# Altium schematic sheet ECG_MCU_Core.SchDoc
size A; SheetNumber: 5; SheetTotal: 5
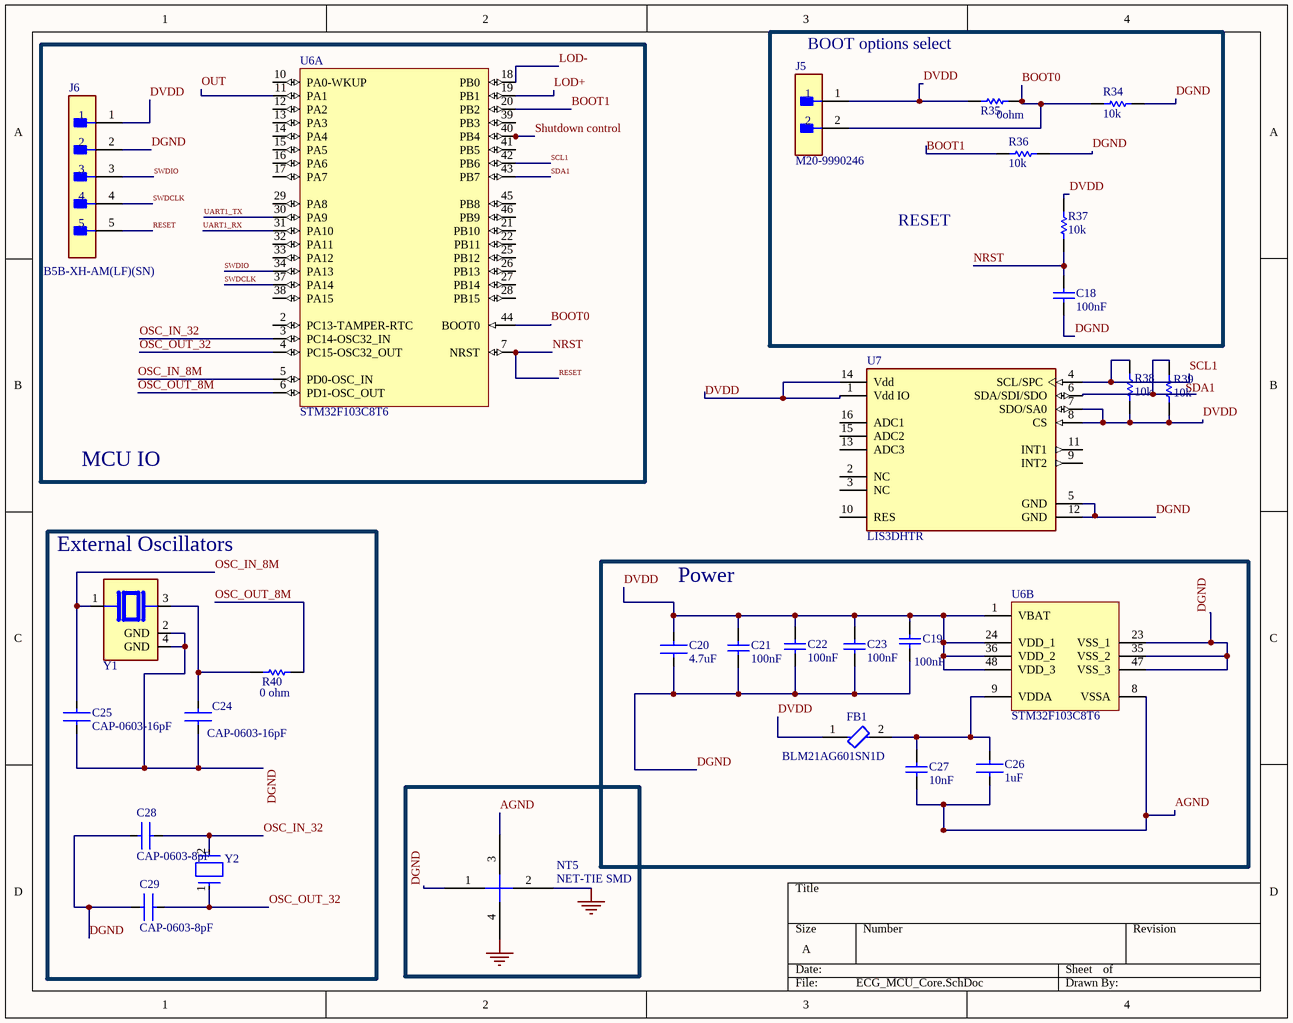
[diagram p0: ECG_MCU_Core.SchDoc]

## Parts
C18  100nF  [CAP-0603-IPC_B]
C19  100nF  [CAP-0603-IPC_B]
C20  4.7uF  [CAP-0805-IPC_B]
C21  100nF  [CAP-0603-IPC_B]
C22  100nF  [CAP-0603-IPC_B]
C23  100nF  [CAP-0603-IPC_B]
C24  CAP-0603-16pF  [FP-GCM188-0_1-IPC_A_murata]
C25  CAP-0603-16pF  [FP-GCM188-0_1-IPC_A_murata]
C26  1uF  [CAP-0805-IPC_B]
C27  10nF  [CAP-0603-IPC_B]
C28  CAP-0603-8pF  [FP-GCM188-0_1-IPC_A_murata]
C29  CAP-0603-8pF  [FP-GCM188-0_1-IPC_A_murata]
FB1  BLM21AG601SN1D  [Ferrite bead]
J5  M20-9990246  [FP-M20-9990246-MFG]
J6  B5B-XH-AM(LF)(SN)  [FP-B5B-XH-AM_LF_SN-MFG]
NT5  NET-TIE SMD  [NET TIE SMD]
R34  10k  [RES-0603-IPC_B]
R35  0ohm  [RES-0603-IPC_B]
R36  10k  [RES-0603-IPC_B]
R37  10k  [RES-0603-IPC_B]
R38  10k  [RES-0603-IPC_B]
R39  10k  [RES-0603-IPC_B]
R40  0 ohm  [RES-0603-IPC_B]
U6  STM32F103C8T6  [STM-LQFP48_M]  (parts A,B of 2)
U7  LIS3DHTR  [FP-LGA-16-7983231-MFG]
Y1  ABM8AIG-8.000MHZ-1Z-T_1  [XTAL_ABM8AIG-8.000MHZ-1Z-T]  (value not drawn)
Y2  ABS07-32.768KHZ-6-T  [FP-ABS07-MFG]  (value not drawn)

## Blocks framed on the sheet
MCU IO: J6 U6
External Oscillators: C24 C25 C28 C29 R40 Y1 Y2
Power: C19-C23 C26 C27 FB1 U6

## Nets
GND: NT5.2
AGND: C26.1 C27.1 NT5.3 U6.8(VSSA)
BOOT0: J5.2 R34.1 R35.2 U6.44(BOOT0)
BOOT1: R36.1 U6.20(PB2)
DGND: C18.1 C19.1 C20.2 C21.1 C22.1 C23.1 C24.1 C25.1 C28.2 C29.1 J6.2 NT5.1 R34.2 R36.2 U6.23(VSS_1) U6.35(VSS_2) U6.47(VSS_3) U7.5(GND) U7.12(GND) Y1.2(GND) Y1.4(GND)
DVDD: C19.2 C20.1 C21.2 C22.2 C23.2 FB1.1 J5.1 J6.1 R35.1 R37.2 R38.1 R39.1 U6.1(VBAT) U6.24(VDD_1) U6.36(VDD_2) U6.48(VDD_3) U7.1(Vdd_IO) U7.7(SDO/SA0) U7.8(CS) U7.14(Vdd)
LOD+: U6.19(PB1)
LOD-: U6.18(PB0)
NRST: C18.2 J6.5 R37.1 U6.7(NRST)  [also labelled RESET]
OSC_IN_8M: C25.2 U6.5(PD0-OSC_IN) Y1.1
OSC_IN_32: C28.1 U6.3(PC14-OSC32_IN) Y2.2
OSC_OUT_8M: R40.2 U6.6(PD1-OSC_OUT)
OSC_OUT_32: C29.2 U6.4(PC15-OSC32_OUT) Y2.1
OUT: U6.11(PA1)
SCL1: R38.2 U6.42(PB6) U7.4(SCL/SPC)
SDA1: U6.43(PB7)
Shutdown control: U6.40(PB4)
SWDCLK: J6.4 U6.37(PA14)
SWDIO: J6.3 U6.34(PA13)
UART1_RX: U6.31(PA10)
UART1_TX: U6.30(PA9)
NetC24_2: C24.2 R40.1 Y1.3
NetC26_2: C26.2 C27.2 FB1.2 U6.9(VDDA)
NetR39_2: R39.2 U7.6(SDA/SDI/SDO)

Not connected (* = marked no-connect by the designer): NT5 4; U6 2(PC13-TAMPER-RTC) 10(PA0-WKUP) 12(PA2) 13(PA3) 14(PA4) 15(PA5) 16(PA6) 17(PA7) 21(PB10) 22(PB11) 25(PB12) 26(PB13) 27(PB14) 28(PB15) 29(PA8) 32(PA11) 33(PA12) 38(PA15) 39(PB3) 41(PB5) 45(PB8) 46(PB9); U7 2(NC) 3(NC) 9(INT2) 10(RES) 11(INT1) 13(ADC3) 15(ADC2) 16(ADC1)

## Notes on the sheet
- BOOT options select
- RESET
- Labels drawn without touching a wire or pin: GND, SDA1

## Library data of the parts
C18 = 1nF CAP-0603-IPC-B_1: Manufacturer: AVX Interconnect / Elco; Part Number: 0603ZC103MAT2A
C19 C21-C23 C27 = CAP-0603-IPC-B: Manufacturer: AVX Interconnect / Elco; Part Number: 0603ZC103MAT2A
C20 = 4.7uF CAP-0805-IPC-B_1
C24 C25 = CAP-0603_16V- 16pf_murata: Ceramic Capacitor for Automotive 16pF  ±5% 100VDC C0G 0603 Paper T/R; Voltage Rating: 100V; Min Operating Temperature: -55°C; Package Quantity: 4000; Case/Package: 0603; Height: 0.8mm; Tolerance: 5%; Depth: 0.8mm; Thickness: 0.035inch; Max Operating Temperature: 125°C; Ratings: AEC-Q200; Packaging: Tape and Reel; Termination: SMD/SMT; Mount: Surface Mount; Voltage Rating (DC): 100V; Case Code (Imperial): 0603; Length: 1.6mm; Capacitance: 16pF; Case Code (Metric): 1608; Dielectric: C0G; Radiation Hardening: No; Width: 0.031inch
C26 = 1uF CAP-0805-IPC-B_1
C28 C29 = CAP-0603_16V- 8pF_murata: Ceramic Capacitor for Automotive 16pF  ±5% 100VDC C0G 0603 Paper T/R; Voltage Rating: 100V; Min Operating Temperature: -55°C; Package Quantity: 4000; Case/Package: 0603; Height: 0.8mm; Tolerance: 5%; Depth: 0.8mm; Thickness: 0.035inch; Max Operating Temperature: 125°C; Ratings: AEC-Q200; Packaging: Tape and Reel; Termination: SMD/SMT; Mount: Surface Mount; Voltage Rating (DC): 100V; Case Code (Imperial): 0603; Length: 1.6mm; Capacitance: 16pF; Case Code (Metric): 1608; Dielectric: C0G; Radiation Hardening: No; Width: 0.031inch
FB1 = CMP-0686-00639-3 Ferrite bead: Chip Ferrite Bead, 0805, 600Ω @ 100MHz, 0.2Ω, 25%, 700mA; Material: Steel; DC Current: 200mA; Impedance: 600R; Current Rating: 600mA; Number of Circuits: 1; Shielding: Unshielded; DC Resistance (DCR): 210mR; Temperature Coefficient: 10ppm/°C; Conductor Material: Copper; Radiation Hardening: No; Test Frequency: 100MHz; Height: 0.85mm; Max Current Rating: 700mA; REACH SVHC: No SVHC; Case Code (Metric): 2012; Max DC Current: 200mA; Min Operating Temperature: -55°C; ESR (Equivalent Series Resistance): 600R; Case/Package: 0805; Tolerance: 25%; Number of Pins: 2; Depth: 1.25mm; Lead Free: Lead Free; Frequency: 100MHz; Length: 2mm; Package Quantity: 1; Max Operating Temperature: 125°C; Case Code (Imperial): 0805; Width: 1.25mm; Core Material: Ferrite; RoHS Compliant: Yes; Termination: SMD/SMT; Number of Lines: 1; Packaging: Tape and Reel
J5 = CMP-15831-000009-1: CONN HEADER VERT 2POS 2.54MM; Manufacturer: Harwin; Conn Gender: Male; Conn Orientation: Vertical; Number Of Contacts: 2; Current Rating: 3A; ComponentLink2URL: https://cdn.harwin.com/pdfs/M20-999.pdf; ComponentLink2Description: Datasheet; Package: M20-9990246; Temperature: -40°C to +105°C; Octopart: https://octopart.com/m20-9990246-harwin-2590635; Mouser Description: 2.54mm (0.1") Pitch SIL Vertical PC Tail Pin Header, 6.1mm mating pin height, tin, 2 contacts; Temperature Range High: +105°C; Device Class L1: Connectors; RoHS: TRUE; Automotive: No; Height: 8.99mm; Number Of Rows: 1; Contact Material: Tin,Nickel; Category: Conn; Pitch: 2.54mm; Lead Free: Yes; Digikey Description: CONN HEADER VERT 2POS 2.54MM; Manufacturer Part Number: M20-9990246; Temperature Range Low: -40°C; Device Class L3: unset; Device Class L2: Headers and Wire Housings
J6 = CMP-17439-000304-1: CONN HEADER VERT 5POS 2.5MM; Mated Stacking Heights: 9.8mm; Voltage Rating: 250V; Max Current Rating: 3A; Number of Positions: 5; Contact Resistance: 20mR; Depth: 5.75mm; Connector Type: Header; Color: Green; Insulation Material: Nylon; Contact Plating: Copper; Length: 14.9mm; Fastening Type: Detent; Contact Material: Brass; Number of Rows: 1; Contact Type: Male Pin; Housing Material: Polyamide; Housing Color: White; Lead Free: Lead Free; Max Voltage Rating (AC): 250V; Mount: Through Hole; Contact Shape: Square; Min Operating Temperature: -25°C; Packaging: Bulk; Orientation: Straight; Insulation Color: Natural; Series: XH; Flammability Rating: UL94 V-0; Contact Finish - Mating: TIN; Max Operating Temperature: 85°C; Termination: Solder; Pitch: 2.5mm
R34 R36-R39 = 10k RES-0603-IPC-B_1_1: Max Power Dissipation: 100mW; Temperature Coefficient: 50ppm/°C; Tolerance: 0.5%; Resistance: 4.7kR; Height: 0.022inch; Width: 0.032inch; RoHS Compliant: Yes; Features: Moisture Resistant; Packaging: Tape and Reel; Number of Terminations: 2; Max Operating Temperature: 155°C; Series: AT; Min Operating Temperature: -55°C; Resistor Type: Thin Film; Length: 0.063inch; Case/Package: 0603
R35 = 1k RES-0603-IPC-B_1: Max Power Dissipation: 100mW; Temperature Coefficient: 50ppm/°C; Tolerance: 0.5%; Resistance: 4.7kR; Height: 0.022inch; Width: 0.032inch; RoHS Compliant: Yes; Features: Moisture Resistant; Packaging: Tape and Reel; Number of Terminations: 2; Max Operating Temperature: 155°C; Series: AT; Min Operating Temperature: -55°C; Resistor Type: Thin Film; Length: 0.063inch; Case/Package: 0603
R40 = RES-0603-IPC-B: Max Power Dissipation: 100mW; Temperature Coefficient: 50ppm/°C; Tolerance: 0.5%; Resistance: 4.7kR; Height: 0.022inch; Width: 0.032inch; RoHS Compliant: Yes; Features: Moisture Resistant; Packaging: Tape and Reel; Number of Terminations: 2; Max Operating Temperature: 155°C; Series: AT; Min Operating Temperature: -55°C; Resistor Type: Thin Film; Length: 0.063inch; Case/Package: 0603
U6 = STM32F103C8T6: MCU 32-bit STM32F1 ARM Cortex M3 RISC 64KB Flash 2.5V/3.3V 48-Pin LQFP Tray; Manufacturer: STMicroelectronics; Manufacturer Package Identifier: ai14911d; Core: ARM Cortex-M3; Supply Voltage(Vcc) min (V): 2; Internal RAM Size (kB): 20; FLASH Size (Prog) (kB): 64; A/D Converter: 2x12-bit (10 Channel); I/Os (High Current): 37; Operating Frequency(F) (Processor speed) (MHz): 72; ADC Channels (Resolution): 10-Ch 12-Bit; Address Bus Width: 32b; Density: 512kb; EEPROM Memory Size: 0B; Frequency: 72MHz; Interface: CAN, USB; Clock Frequency: 16MHz; Max Power Dissipation: 363mW; Max Supply Current: 50mA; Max Supply Voltage: 3.6V; Min Supply Voltage: 2V; Nominal Supply Current: 1.7µA; Number of ADC Channels: 10; Number of Bits: 32; Number of Interrupts: 16; Number of Programmable I/O: 48; Number of PWM Channels: 1; Number of Timers/Counters: 4; Number of USART Channels: 3; Operating Supply Voltage: 3.3V; Oscillator Type: Internal; Peripherals: POR; RAM Size: 20kB; Watchdog Timer: Yes; ComponentLink3Description: Package Specification; Mounting Technology: Surface Mount; PartNumber: STM32F103C8T6; PackageReference: LQFP48; Packing: Tray; ComponentLink3URL: http://www.st.com/st-web-ui/static/active/en/resource/technical/document/datasheet/DM00058181.pdf; DatasheetVersion: Rev. 16; ComponentLink1URL: http://www.st.com/web/en/home.html; PackageVersion: Rev. 6, 06/2013; ComponentLink2URL: http://www.st.com/st-web-ui/static/active/en/resource/technical/document/datasheet/CD00161566.pdf; ComponentLink1Description: Manufacturer URL; ComponentLink2Description: Datasheet; PackageDescription: 48-Pin Low Profile Quad Flat Package, 7 x 7 mm Body, 0.5 mm Pitch; Supplier: DigiKey; Supplier Part Number: 497-6063-ND; Manufacturer Part Number: STM32F103C8T6; RoHS: Compliant; Category: Microcontrollers; Stock: 1445; Pricing: 1=6.15, 10=4.713, 25=4.3536, 100=3.9587, 250=3.77048, 500=3.657, 1000=3.5636, 2500=3.46503 (USD); Case/Package: LFQFP; China RoHS: Compliant; Core Architecture: ARM; Country of Origin: Malaysia; Data Bus Width: 32b; Export Control Classification Number (ECCN) Code: 3A991.A.2; Flash Memory Size: 64kB; Height: 1.45mm; Height - Seated (Max): 1.6mm; Harmonized Tariff Schedule (HTS) Code: 8542.31.00.25; Introduction Date: 2007-06-07; Lead Free: Lead Free; Length: 7mm; Lifecycle Status: Production; Max Operating Temperature: 85°C; Memory Size: 64kB; Memory Format: FLASH; Min Operating Temperature: -40°C; Number of A/D Converters: 2; Number of Channels: 10; Number of I2C Channels: 2; Number of I/Os: 37; Pins: 48; Number of SPI Channels: 2; Number of Terminals: 48; Radiation Hardening: No; REACH SVHC: Yes; Schedule B: 8542310000; Temperature Grade: Industrial; Terminal Pitch: 500µm; Termination: SMD/SMT; Width: 7mm; ComponentLink4URL: https://datasheet.octopart.com:443/STM32F103C8T6-STMicroelectronics-datasheet-177520228.pdf?src-supplier=IHS; ComponentLink4Description: https://datasheet.octopart.com:443/STM32F103C8T6-STMicroelectronics-datasheet-177520228.pdf?src-supplier=IHS; ComponentLink5URL: https://datasheet.octopart.com:443/STM32F103C8T6-STMicroelectronics-datasheet-10330614.pdf?src-supplier=Newark; ComponentLink5Description: https://datasheet.octopart.com:443/STM32F103C8T6-STMicroelectronics-datasheet-10330614.pdf?src-supplier=Newark; ComponentLink6URL: https://datasheet.octopart.com:443/STM32F103C8T6-STMicroelectronics-datasheet-16839800.pdf?src-supplier=Newark; ComponentLink6Description: https://datasheet.octopart.com:443/STM32F103C8T6-STMicroelectronics-datasheet-16839800.pdf?src-supplier=Newark; ComponentLink7URL: https://datasheet.octopart.com:443/STM32F103C8T6-STMicroelectronics-datasheet-48026265.pdf?src-supplier=ICpick; ComponentLink7Description: https://datasheet.octopart.com:443/STM32F103C8T6-STMicroelectronics-datasheet-48026265.pdf?src-supplier=ICpick; ComponentLink8URL: https://datasheet.octopart.com:443/STM32F103C8T6-STMicroelectronics-datasheet-14363502.pdf?src-supplier=Farnell; ComponentLink8Description: https://datasheet.octopart.com:443/STM32F103C8T6-STMicroelectronics-datasheet-14363502.pdf?src-supplier=Farnell; ComponentLink9URL: https://datasheet.octopart.com:443/STM32F103C8T6-STMicroelectronics-datasheet-500013.pdf?src-supplier=Farnell; ComponentLink9Description: https://datasheet.octopart.com:443/STM32F103C8T6-STMicroelectronics-datasheet-500013.pdf?src-supplier=Farnell; ComponentLink10URL: https://datasheet.octopart.com:443/STM32F103C8T6-STMicroelectronics-datasheet-8365036.pdf?src-supplier=Farnell; ComponentLink10Description: https://datasheet.octopart.com:443/STM32F103C8T6-STMicroelectronics-datasheet-8365036.pdf?src-supplier=Farnell; ComponentLink11URL: https://datasheet.octopart.com:443/STM32F103C8T6-STMicroelectronics-datasheet-6396519.pdf?src-supplier=Verical; ComponentLink11Description: https://datasheet.octopart.com:443/STM32F103C8T6-STMicroelectronics-datasheet-6396519.pdf?src-supplier=Verical; ComponentLink12URL: https://datasheet.octopart.com:443/STM32F103C8T6-STMicroelectronics-datasheet-21407612.pdf?src-supplier=element14+APAC; ComponentLink12Description: https://datasheet.octopart.com:443/STM32F103C8T6-STMicroelectronics-datasheet-21407612.pdf?src-supplier=element14+APAC; ComponentLink13URL: https://datasheet.octopart.com:443/STM32F103C8T6-STMicroelectronics-datasheet-8700640.pdf?src-supplier=element14; ComponentLink13Description: https://datasheet.octopart.com:443/STM32F103C8T6-STMicroelectronics-datasheet-8700640.pdf?src-supplier=element14; ComponentLink14URL: https://datasheet.octopart.com:443/STM32F103C8T6-STMicroelectronics-datasheet-165583531.pdf?src-supplier=SOS+electronic; ComponentLink14Description: https://datasheet.octopart.com:443/STM32F103C8T6-STMicroelectronics-datasheet-165583531.pdf?src-supplier=SOS+electronic; ComponentLink15URL: https://datasheet.octopart.com:443/STM32F103C8T6-STMicroelectronics-datasheet-14106722.pdf?src-supplier=iiiC; ComponentLink15Description: https://datasheet.octopart.com:443/STM32F103C8T6-STMicroelectronics-datasheet-14106722.pdf?src-supplier=iiiC; ComponentLink16URL: https://datasheet.octopart.com:443/STM32F103C8T6-STMicroelectronics-datasheet-17594274.pdf?src-supplier=TME; ComponentLink16Description: https://datasheet.octopart.com:443/STM32F103C8T6-STMicroelectronics-datasheet-17594274.pdf?src-supplier=TME; ComponentLink17URL: https://datasheet.octopart.com:443/STM32F103C8T6-STMicroelectronics-datasheet-148251.pdf?src-supplier=Nu+Horizons; ComponentLink17Description: https://datasheet.octopart.com:443/STM32F103C8T6-STMicroelectronics-datasheet-148251.pdf?src-supplier=Nu+Horizons
U7 = CMP-0234-00055-6: ACCEL 2-16G I2C/SPI 16LGA; Max Supply Voltage: 3.6V; Bandwidth: 5kHz; Min Supply Voltage (DC): 1.71V; Interface: I2C; Axis: X, Y, Z; Operating Supply Voltage: 2.5V; Operating Supply Current: 11uA; Output Type: Digital; Resolution: 16b; Sensor Type: 3 Axis; Series: -; Package Quantity: 1; Case/Package: LGA; Radiation Hardening: No; Min Operating Temperature: -40°C; Length: 3mm; Max Supply Voltage (DC): 3.6V; Lead Free: Lead Free; Height: 1mm; Number of Pins: 16; RoHS Compliant: Yes; Packaging: Tape and Reel; Width: 3mm; Contact Plating: Gold; Max Operating Temperature: 85°C; Min Supply Voltage: 1.71V; REACH SVHC: No SVHC; Depth: 3mm
Y1 = ABM8AIG-8.000MHZ-1Z-T_1: Crystal, Aec-Q200, 8Mhz, 3.2Mm X 2.5Mm Rohs Compliant: Yes |Abracon ABM8AIG-8.000MHZ-1Z-T; MF: Abracon LLC; Frequency Stability: 50ppm; Frequency Tolerance: 0.001%; Load Capacitance: 18pF; ESR: 500Ω; SnapEDA_Link: https://www.snapeda.com/parts/ABM8AIG-8.000MHZ-1Z-T/Abracon/view-part/?ref=snap; Package: NON STANDARD Abracon; Value: *; MP: ABM8AIG-8.000MHZ-1Z-T; Check_prices: https://www.snapeda.com/parts/ABM8AIG-8.000MHZ-1Z-T/Abracon/view-part/?ref=eda; Supplier: DigiKey; Supplier Part Number: 535-15256-6-ND; Manufacturer: Abracon; Manufacturer Part Number: ABM8AIG-8.000MHZ-1Z-T; RoHS: Compliant; Category: Crystals; Pricing: 1=1.1, 10=0.959, 25=0.9064, 50=0.869, 100=0.833, 250=0.78776, 500=0.75518 (USD); China RoHS: Compliant; Country of Origin: Taiwan; Frequency: 8MHz; Introduction Date: 2019-06-13; Lifecycle Status: Production; Max Operating Temperature: 125°C; Min Operating Temperature: -40°C; Mounting Technology: Surface Mount; REACH SVHC: Yes; ComponentLink1URL: https://datasheet.octopart.com:443/ABM8AIG-8.000MHZ-1Z-T-Abracon-datasheet-154833173.pdf?src-supplier=Master+Electronics; ComponentLink1Description: https://datasheet.octopart.com:443/ABM8AIG-8.000MHZ-1Z-T-Abracon-datasheet-154833173.pdf?src-supplier=Master+Electronics; ComponentLink2URL: https://datasheet.octopart.com:443/ABM8AIG-8.000MHZ-1Z-T-Abracon-datasheet-78375026.pdf?src-supplier=JRH+Electronics; ComponentLink2Description: https://datasheet.octopart.com:443/ABM8AIG-8.000MHZ-1Z-T-Abracon-datasheet-78375026.pdf?src-supplier=JRH+Electronics; ComponentLink3URL: http://sigma.octopart.com:80/conflict_mineral_statement/Abracon-company-27.pdf?src-supplier=Compliance+Statements; ComponentLink3Description: http://sigma.octopart.com:80/conflict_mineral_statement/Abracon-company-27.pdf?src-supplier=Compliance+Statements
Y2 = CMP-2000-05735-3: Crystal 32.768kHz ±20ppm (Tol) 6pF FUND 70kΩ 2-Pin CSMD T/R; ESR (Equivalent Series Resistance): 70kR; Length: 3.2mm; Packaging: Tape and Reel; Number of Pins: 2; Min Operating Temperature: -40°C; Mount: Surface Mount; REACH SVHC: No SVHC; Lead Free: Lead Free; Termination: SMD/SMT; Case/Package: CSMD; Frequency Tolerance: 20ppm; Frequency: 32.768kHz; Radiation Hardening: No; Tolerance: 20ppm; Series Resistance: 70kR; Width: 1.5mm; Load Capacitance: 6pF; RoHS Compliant: Yes; Package Quantity: 3000; Depth: 1.5mm; Max Operating Temperature: 85°C; Height: 0.9mm; Operating Frequency: 32.768 kHz; Series: ABS07